# EAGLE design Solar_charger_v2 (EAGLE 8.3.2)
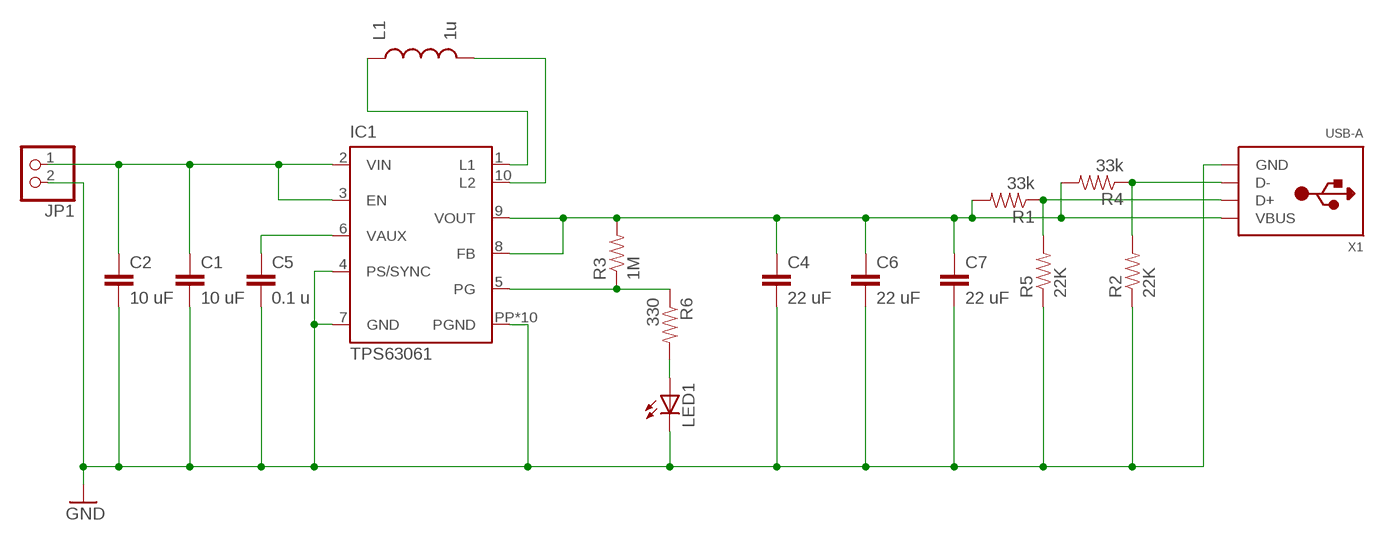
[diagram p0: schematic, sheet 1]

## Parts
C1  10 uF  CAP1206  [1206]
C2  10 uF  CAP1206  [1206]
C4  22 uF  CAP1206  [1206]
C5  0.1 u  CAP1206  [1206]
C6  22 uF  CAP1206  [1206]
C7  22 uF  CAP1206  [1206]
IC1  TPS63061  [DSC-S-PWSON-N10]
JP1  JST_2PIN-SMT  [JST-PH-2-SMT]
L1  1u  INDUCTOR1210  [1210]
LED1  LEDSML0805  [SML0805]
R1  33k  RESISTOR1206  [1206]
R2  22K  RESISTOR1206  [1206]
R3  1M  RESISTOR1206  [1206]
R4  33k  RESISTOR1206  [1206]
R5  22K  RESISTOR1206  [1206]
R6  330  RESISTOR1206  [1206]
X1  USB-A  [MOLEX_480371000]

## Nets
GND: C1.2 C2.2 C4.2 C5.2 C6.2 C7.2 IC1.4(PS/SYNC) IC1.7(GND) IC1.PP(PGND) IC1.PP@1(PGND) IC1.PP@2(PGND) IC1.PP@3(PGND) IC1.PP@4(PGND) IC1.PP@5(PGND) IC1.PP@7(PGND) IC1.PP@8(PGND) IC1.PP@9(PGND) IC1.PP@10(PGND) JP1.2 LED1.C R2.1 R5.1 X1.4(GND)
N$1: IC1.10(L2) L1.2
N$2: IC1.1(L1) L1.1
N$3: IC1.5(PG) R3.1 R6.1
N$4: C5.1 IC1.6(VAUX)
N$6: R2.2 R4.1 X1.2(D-)
N$7: LED1.A R6.2
N$8: R1.1 R5.2 X1.3(D+)
VIN: C1.1 C2.1 IC1.2(VIN) IC1.3(EN) JP1.1
VOUT: C4.1 C6.1 C7.1 IC1.8(FB) IC1.9(VOUT) R1.2 R3.2 R4.2 X1.1(VBUS)

## Library data of the parts
C1 C2 C4-C7 = SparkFun-Passives:CAP: Capacitor Standard 0603 ceramic capacitor, and 0.1" leaded capacitor.
IC1 = texas:TPS6306*: HIGH INPUT VOLTAGE BUCK-BOOST CONVERTER WITH 2A SWITCH CURRENT Source: http://www.ti.com/lit/ds/symlink/tps63060.pdf
JP1 = adafruit:JST_2PIN: JST 2-Pin Connectors of various flavors SMT-RA (S2B-PH-SM4) 4UConnector #17311 SMT (B2B-PH-SM4) THM-RA (S2B-PH) THM (B2B-PH)
L1 = SparkFun-Passives:INDUCTOR: Inductors Basic Inductor/Choke - 0603 and 1206. Footprints are not proven and vary greatly between part numbers. INDUCTOR POWER 3.3UH 4.0A SMD 0.197" L x 0.197" W x 0.177" H (5.00mm x 5.00mm x 4.50mm)
LED1 = led:LED: LED OSRAM: - CHIPLED LG R971, LG N971, LY N971, LG Q971, LY Q971, LO R971, LY R971 LH N974, LH R974 LS Q976, LO Q976, LY Q976 LO Q996 - Hyper CHIPLED LW Q18S LB Q993, LB Q99A, LB R99A - SideLED LS A670, LO A670, LY A670, LG A670, LP A670 LB A673, LV A673, LT A673, LW A673 LH A674 LY A675 LS A676, LA A676, LO A676, LY A676, LW A676 LS A679, LY A679, LG A679 - Hyper Micro SIDELED® LS Y876, LA Y876, LO Y876, LY Y876 LT Y87S - SmartLED LW L88C, LW L88S LB L89C, LB L89S, LG L890 LS L89K, LO L89K, LY L89K LS L896, LA L896, LO L896, LY L896 - TOPLED LS T670, LO T670, LY T670, LG T670, LP T670 LSG T670, LSP T670, LSY T670, LOP T670, LYG T670 LG T671, LOG T671, LSG T671 LB T673, LV T673, LT T673, LW T673 LH T674 LS T676, LA T676, LO T676, LY T676, LB T676, LH T676, LSB T676, LW T676 LB T67C, LV T67C, LT T67C, LS T67K, LO T67K, LY T67K, LW E67C LS E67B, LA E67B, LO E67B, LY E67B, LB E67C, LV E67C, LT E67C LW T67C LS T679, LY T679, LG T679 LS T770, LO T770, LY T770, LG T770, LP T770 LB T773, LV T773, LT T773, LW T773 LH T774 LS E675, LA E675, LY E675, LS T675 LS T776, LA T776, LO T776, LY T776, LB T776 LHGB T686 LT T68C, LB T68C - Hyper Mini TOPLED® LB M676 - Mini TOPLED Santana® LG M470 LS M47K, LO M47K, LY M47K Source: http://www.osram.convergy.de LUXEON: - LUMILED® LXK2-PW12-R00, LXK2-PW12-S00, LXK2-PW14-U00, LXK2-PW14-V00 LXK2-PM12-R00, LXK2-PM12-S00, LXK2-PM14-U00 LXK2-PE12-Q00, LXK2-PE12-R00, LXK2-PE12-S00, LXK2-PE14-T00, LXK2-PE14-U00 LXK2-PB12-K00, LXK2-PB12-L00, LXK2-PB12-M00, LXK2-PB14-N00, LXK2-PB14-P00, LXK2-PB14-Q00 LXK2-PR12-L00, LXK2-PR12-M00, LXK2-PR14-Q00, LXK2-PR14-R00 LXK2-PD12-Q00, LXK2-PD12-R00, LXK2-PD12-S00 LXK2-PH12-R00, LXK2-PH12-S00 LXK2-PL12-P00, LXK2-PL12-Q00, LXK2-PL12-R00 Source: www.luxeon.com KINGBRIGHT: KA-3528ASYC Source: www.kingbright.com
R1-R6 = SparkFun-Resistors:RESISTOR: Resistor Basic schematic elements and footprints for 0603, 1206, and PTH resistors.
X1 = adafruit:USB-A: USB type A 'plug' Used for things that can directly connect to a USB port, say USB key

## Board
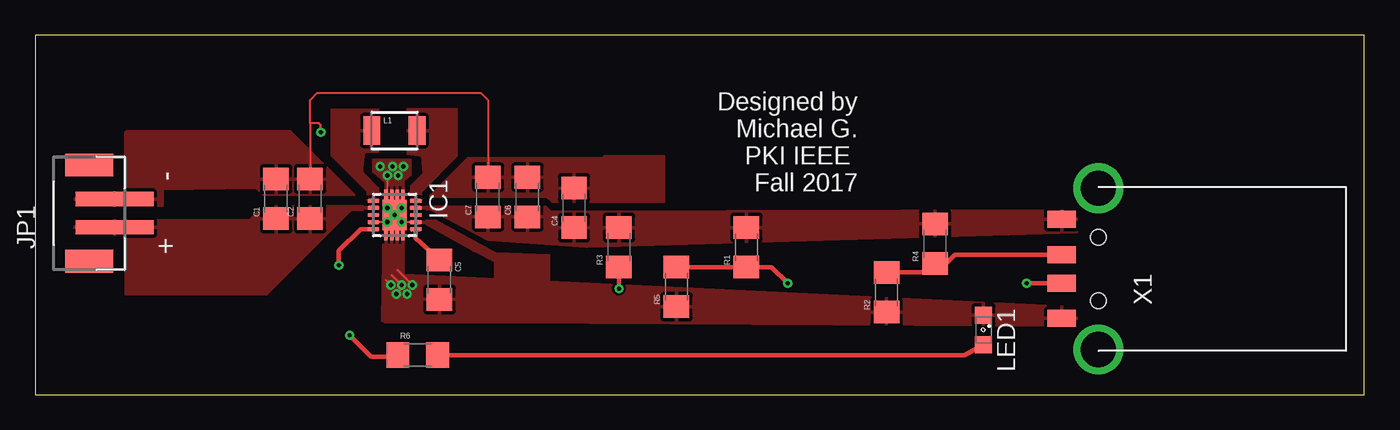
[diagram p1: board, top side]
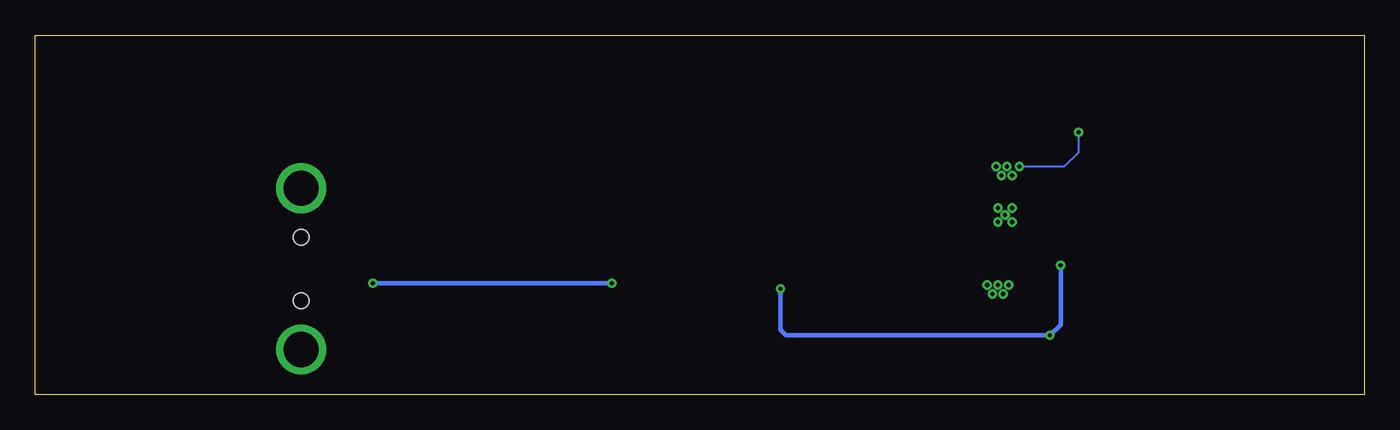
[diagram p2: board, bottom side, seen from below]

Size 93.98 x 25.4 mm. Coordinates in mm from the lower left corner, seen from the top.
Outline: 0,0 93.98,0 93.98,25.4 0,25.4 0,0
Copper layers (1*16): Top 0.0356mm / dielectric 1.5011mm / Bottom 0.0356mm
Design rules "LaenPCBOrder": minimum track width 6mil, minimum drill 13mil, track to track 6mil, track to pad 6mil, pad to pad 6mil, via to via 6mil, smd to smd 6mil, copper to edge 15mil, drill to drill 6mil, minimum pad ring 7mil, minimum via ring 7mil, stop-mask expansion 3mil, vias tented up to drill 0mil, thermal gap 10mil

### Footprints (pad centres in the part's own frame; a part is rotated, then mirrored left to right if it is on the bottom)
1206 = smd 1.6 x 1.8: 1 -1.4,0; 2 1.4,0
DSC-S-PWSON-N10 = smd 0.28 x 0.85: 1 -1,-1.488; 2 -0.5,-1.488; 3 0,-1.488; 4 0.5,-1.488; 5 1,-1.488; 6 1,1.5; 7 0.5,1.5; 8 0,1.5; 9 -0.5,1.5; 10 -1,1.5 | smd 2.15 x 1.7: PP 0,0 | smd 3.55 x 0.25: PP@1 0,0.6; PP@2 0,0.2; PP@3 0,-0.2; PP@4 0,-0.6 | drill 0.3 pad 0.4: PP@5 -0.5,0.5; PP@7 0,0; PP@8 0.5,0.5; PP@9 -0.5,-0.5; PP@10 0.5,-0.5
JST-PH-2-SMT = smd 1 x 5.5: 1 -1,-1.8; 2 1,-1.8 | smd 1.6 x 3.4: NC1 -3.4,0; NC2 3.4,0
1210 = smd 1.2 x 2: 1 -1.6,0; 2 1.6,0
SML0805 = smd 1.2 x 1.2: A 1.05,0; C -1.05,0
MOLEX_480371000 = smd 1.2 x 2: 1 3.5,2.6; 2 1,2.6; 3 -1,2.6; 4 -3.5,2.6 | drill 2.5: M1 -5.7,0; M2 5.7,0 | hole 1.1: -2.25,0; 2.25,0

### Placement (x,y rotation side)
C1  17.02,13.84 90 top
C2  19.43,13.84 90 top
C4  38.1,13.21 90 top
C5  28.57,8.13 270 top
C6  34.8,13.97 90 top
C7  32,13.97 90 top
IC1  25.4,12.7 270 top
JP1  3.81,12.83 90 top
L1  25.4,18.67 0 top
LED1  67.06,4.57 270 top
R1  50.29,10.41 90 top
R2  60.2,7.24 90 top
R3  41.27,10.41 90 top
R4  63.63,10.67 90 top
R5  45.34,7.62 90 top
R6  27.05,2.79 0 top
X1  75.18,8.89 90 top

### Tracks (layer width: path | path; a pad name or v marks a point on that pad's centre or on a via)
GND  (via drill 0.3)
  Top 0.152: IC1.4 IC1.PP@10 25.27,12.57 | 19.43,19.18 C2.2 | 19.43,19.18 19.43,20.83 19.94,21.34 31.5,21.34 32,20.83 C7.2 | v20.19,18.54 20.19,19.05 20.07,19.18 19.43,19.18 | 24.8,8.09 v25.15,7.75 | 25.2,8.46 v25.91,7.75 | 25.6,8.82 v26.67,7.75 | 26,7.58 v25.53,7.11 | IC1.PP@7 25.65,12.95 | 26.04,13.34 IC1.PP@5 | IC1.PP@7 IC1.PP@8 IC1.7 | IC1.PP@7 24.62,13.48 | v24.89,15.49 IC1.PP@9 IC1.PP@7
  Bottom 0.152: v24.38,16.13 21.21,16.13 20.19,17.14 v20.19,18.54
  other vias: 26.29,7.11 25.27,16.13 25.65,15.49 26.04,16.13
  pour Top: 22.61,14.1 16.13,14.1 15.62,14.61 9.02,14.48 9.02,13.34 2.79,13.34 2.79,14.22 2.92,14.35 6.35,14.35 6.35,18.54 6.48,18.67 18.03,18.67
  pour Top: 24.77,13.72 24.77,14.99 23.88,15.75 23.88,16.64 26.54,16.64 26.54,15.49 26.04,15.11 26.04,13.72
  pour Top: 24.64,11.68 26.04,11.68 26.04,8.51 73.66,6.22 73.66,4.83 33.4,5.08 24.77,5.08 24.51,5.21
  pour Top: 27.94,13.97 27.94,14.1 30.61,16.76 40.13,16.76 40.26,16.89 44.45,16.89 44.45,13.59 36.58,13.59 36.2,13.97
  pour Top: 26.54,12.06 26.54,12.32 28.32,12.32 32.51,10.03 36.32,9.91 36.32,7.87 32.51,7.87 32.51,9.4 30.99,10.16 27.56,12.06
N$1
  pour Top: 27.3,13.72 27.3,14.35 29.84,16.89 29.84,20.19 26.29,20.19 26.29,17.02 27.3,16.89 27.43,15.62 26.54,14.73 26.54,13.72
N$2
  pour Top: 23.5,13.72 23.5,14.35 20.95,16.89 20.95,20.19 24.26,20.19 24.26,17.14 23.24,17.14 23.11,16 23.11,15.75 24.26,14.61 24.26,13.72
N$3  (via drill 0.3)
  Top 0.305: IC1.5 23,11.7 21.46,10.16 v21.46,9.14 | v41.27,7.49 R3.1 | v22.23,4.19 23.75,2.67 25.52,2.67 R6.1
  Bottom 0.305: v21.46,9.14 21.46,4.95 v22.23,4.19 40.89,4.19 41.27,4.57 v41.27,7.49
N$4
  Top 0.305: IC1.6 26.91,11.06 C5.1
N$6
  Top 0.305: R2.2 63,8.64 R4.1 64.39,9.27 65.02,9.91 72.57,9.91 X1.2
N$7
  Top 0.305: R6.2 65.69,2.79 LED1.A
N$8  (via drill 0.3)
  Top 0.305: R5.2 R1.1 52.07,9.01 v53.21,7.87 | v70.1,7.87 72.57,7.87 X1.3
  Bottom 0.305: v53.21,7.87 v70.1,7.87
VIN
  Top 0.152: IC1.3 IC1.2
  pour Top: 24.26,13.34 16.13,13.34 15.11,12.32 2.79,12.32 2.67,11.3 6.35,11.3 6.35,7.11 16.38,7.11 22.35,13.08 24.26,13.08
VOUT
  Top 0.305: IC1.9 IC1.8
  pour Top: 26.54,13.08 26.54,13.34 36.07,13.34 36.45,12.95 73.66,13.08 73.66,11.43 38.99,10.41 32,10.92 27.94,13.08

### Text on the board
tNames: Designed by / Michael G. / PKI IEEE / Fall 2017